# EAGLE schematic TaylorReceiverSchem (EAGLE 7.2.0)
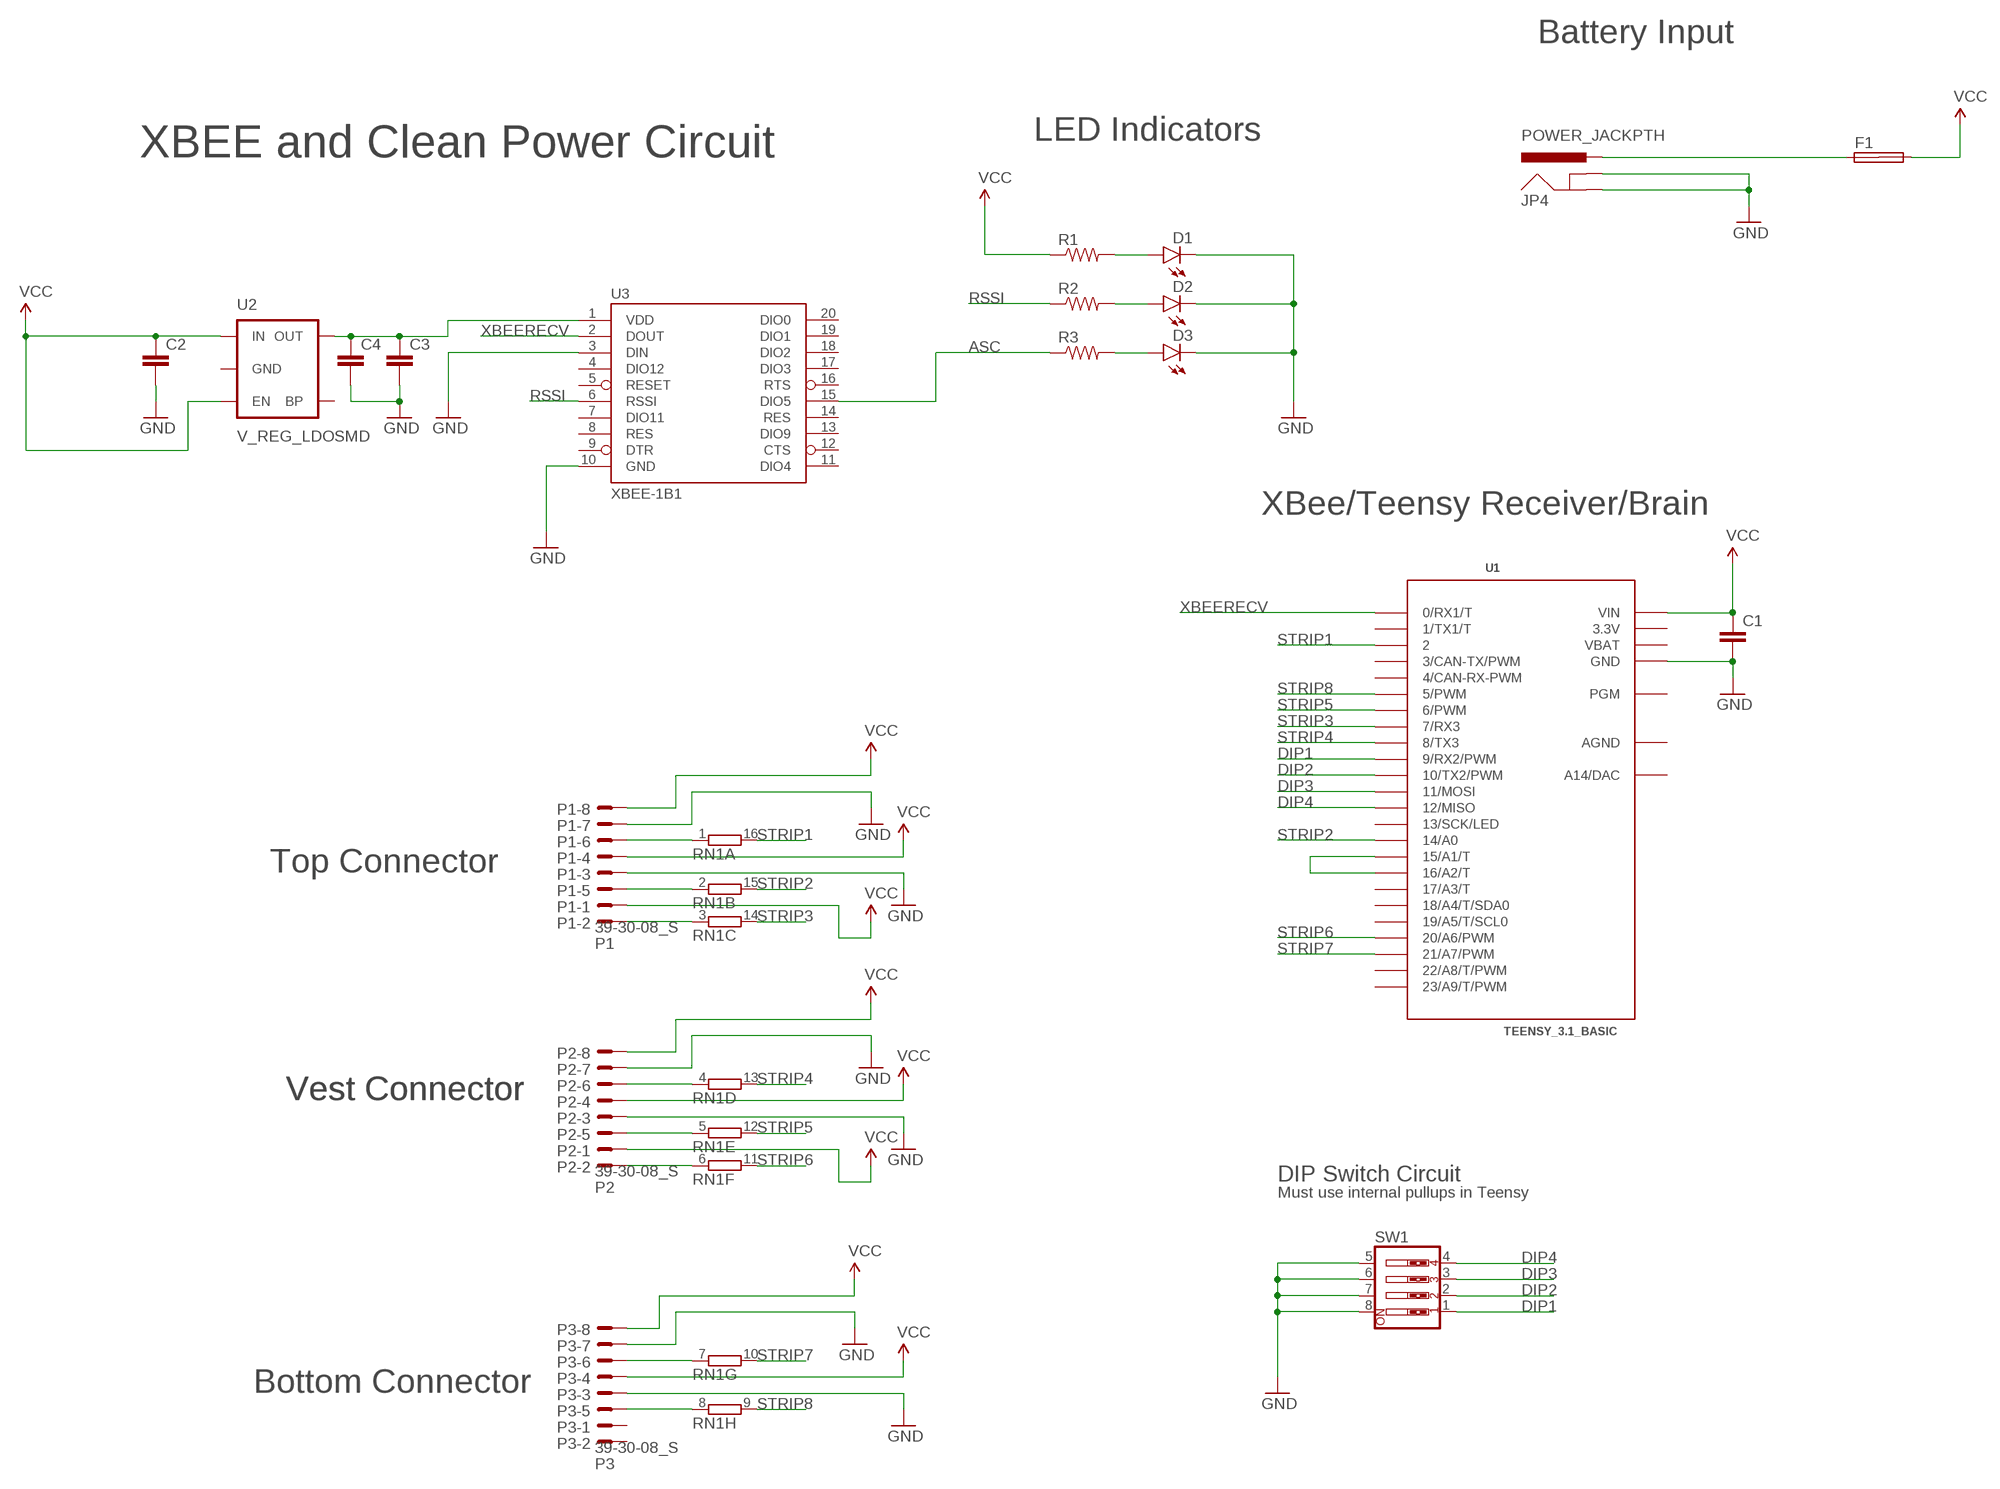
[diagram p0: schematic, sheet 1]

## Parts
C1  CAPPTH1  [CAP-PTH-5MM]
C2  CAPPTH1  [CAP-PTH-5MM]
C3  CAPPTH1  [CAP-PTH-5MM]
C4  CAPPTH1  [CAP-PTH-5MM]
D1  LED5MM  [LED5MM]
D2  LED5MM  [LED5MM]
D3  LED5MM  [LED5MM]
F1  SHK20L  [SHK20L]
JP4  POWER_JACKPTH  [POWER_JACK_PTH]
P1  39-30-08_S  [39-30-?08?]
P2  39-30-08_S  [39-30-?08?]
P3  39-30-08_S  [39-30-?08?]
R1  RESISTORAXIAL-0.3  [AXIAL-0.3]
R2  RESISTORAXIAL-0.3  [AXIAL-0.3]
R3  RESISTORAXIAL-0.3  [AXIAL-0.3]
RN1  8R-N  [DIL16]
SW1  SW_DIP-4  [EDG-04]
U1  TEENSY_3.1_BASIC  [TEENSY_3.1_BASIC]
U2  V_REG_LDOSMD  [SOT23-5]
U3  XBEE-1B1  [XBEE-1]

## Nets
ASC: R3.P$1 U3.15(DIO5)
DIP1: SW1.1 U1.9(9/RX2/PWM)
DIP2: SW1.2 U1.10(10/TX2/PWM)
DIP3: SW1.3 U1.11(11/MOSI)
DIP4: SW1.4 U1.12(12/MISO)
GND: C1.2 C2.2 C3.2 C4.2 D1.K(C) D2.K(C) D3.K(C) JP4.GND JP4.GNDBREAK P1.3 P1.7 P2.3 P2.7 P3.3 P3.7 SW1.5 SW1.6 SW1.7 SW1.8 U1.GND U1.GND1(GND) U3.3(DIN) U3.10(GND)
N$1: U1.15/A1(15/A1/T) U1.16/A2(16/A2/T)
N$2: F1.1A JP4.PWR
N$3: C3.1 C4.1 U2.5(OUT) U3.1(VDD)
N$4: P2.5 RN1.5
N$5: P2.2 RN1.6
N$6: P1.6 RN1.1
N$7: P1.5 RN1.2
N$8: P1.2 RN1.3
N$9: P2.6 RN1.4
N$12: P3.6 RN1.7
N$13: P3.5 RN1.8
N$15: D1.A R1.P$2
N$16: D2.A R2.P$2
N$17: D3.A R3.P$2
RSSI: R2.P$1 U3.6(RSSI)
STRIP1: RN1.16 U1.2
STRIP2: RN1.15 U1.14/A0
STRIP3: RN1.14 U1.7(7/RX3)
STRIP4: RN1.13 U1.8(8/TX3)
STRIP5: RN1.12 U1.6(6/PWM)
STRIP6: RN1.11 U1.20/A6(20/A6/PWM)
STRIP7: RN1.10 U1.21/A7(21/A7/PWM)
STRIP8: RN1.9 U1.5(5/PWM)
VCC: C1.1 C2.1 F1.2A P1.1 P1.4 P1.8 P2.1 P2.4 P2.8 P3.4 P3.8 R1.P$1 U1.VIN U2.1(IN) U2.3(EN)
XBEERECV: U1.0(0/RX1/T) U3.2(DOUT)
Unconnected: F1.1B F1.2B P3.1 P3.2 U1.1(1/TX1/T) U1.3(3/CAN-TX/PWM) U1.4(4/CAN-RX-PWM) U1.13(13/SCK/LED) U1.17/A3(17/A3/T) U1.18/A4(18/A4/T/SDA0) U1.19/A5(19/A5/T/SCL0) U1.22/A8(22/A8/T/PWM) U1.23/A9(23/A9/T/PWM) U1.A14(A14/DAC) U1.PGM U2.2(GND) U2.4(BP) U3.4(DIO12) U3.5(RESET) U3.7(DIO11) U3.8(RES) U3.9(DTR) U3.11(DIO4) U3.12(CTS) U3.13(DIO9) U3.14(RES) U3.16(RTS) U3.17(DIO3) U3.18(DIO2) U3.19(DIO1) U3.20(DIO0)

## Notes on the sheet
- Battery Input
- LED Indicators
- XBEE and Clean Power Circuit
- XBee/Teensy Receiver/Brain
- Top Connector
- Vest Connector | Vest Connector
- DIP Switch Circuit
- Must use internal pullups in Teensy
- Bottom Connector

## Power pins joined to a net without a drawn wire
3.3V: U1.3.3V U1.3.3V1(3.3V)
AGND: U1.AGND
VBAT: U1.VBAT

## Library data of the parts
C1-C4 = SparkFun-Capacitors:CAP: Capacitor Standard 0603 ceramic capacitor, and 0.1" leaded capacitor.
D1-D3 = SparkFun-LED:LED: LEDs Standard schematic elements and footprints for 5mm, 3mm, 1206, and 0603 sized LEDs. 5mm - Spark Fun Electronics SKU : COM-00529 (and others)
F1 = fuse:SHK20L: FUSE HOLDER 5 x 20 mm, SH contact, SHH1 Schukat, E1073 Buerklin; OC_FARNELL: unknown; OC_NEWARK: unknown
JP4 = SparkFun-Connectors:POWER_JACK: Power Jack This is the standard 5.5mm barrel jack for power. The PTH is the most common, proven, reliable, footprint. The Slot footprint only works if the mill layer is transmitted to the PCB fab house so be warned. Mating wall wart : TOL-00298 (and others); PROD_ID: CONN-08197
P1-P3 = con-molex-mini-fit:39-30-?08?_S: HEADER
R1-R3 = SparkFun-Passives:RESISTOR: Resistor Basic schematic elements and footprints for 0603, 1206, and PTH resistors.
RN1 = resistor-dil:8R-N: DIL RESISTOR; OC_FARNELL: unknown; OC_NEWARK: unknown
SW1 = special:SW_DIP-4: DIP SWITCH
U1 = Teensy_3_Series_Board_v1.0:TEENSY_3.1_BASIC: Footprint for Teensy 3.1 board using all pin connections on the outer perimeter
U2 = SparkFun-PowerIC:V_REG_LDO: Voltage Regulator LDO Standard 150mA LDO voltage regulator in SOT-23 layout. Micrel part MIC5205. BP (by-pass) pin is used to lower output noise with 470pF cap.
U3 = SparkFun-RF:XBEE-1: Xbee module footprints